# EasyEDA schematic EasyEDA Device Schem.json
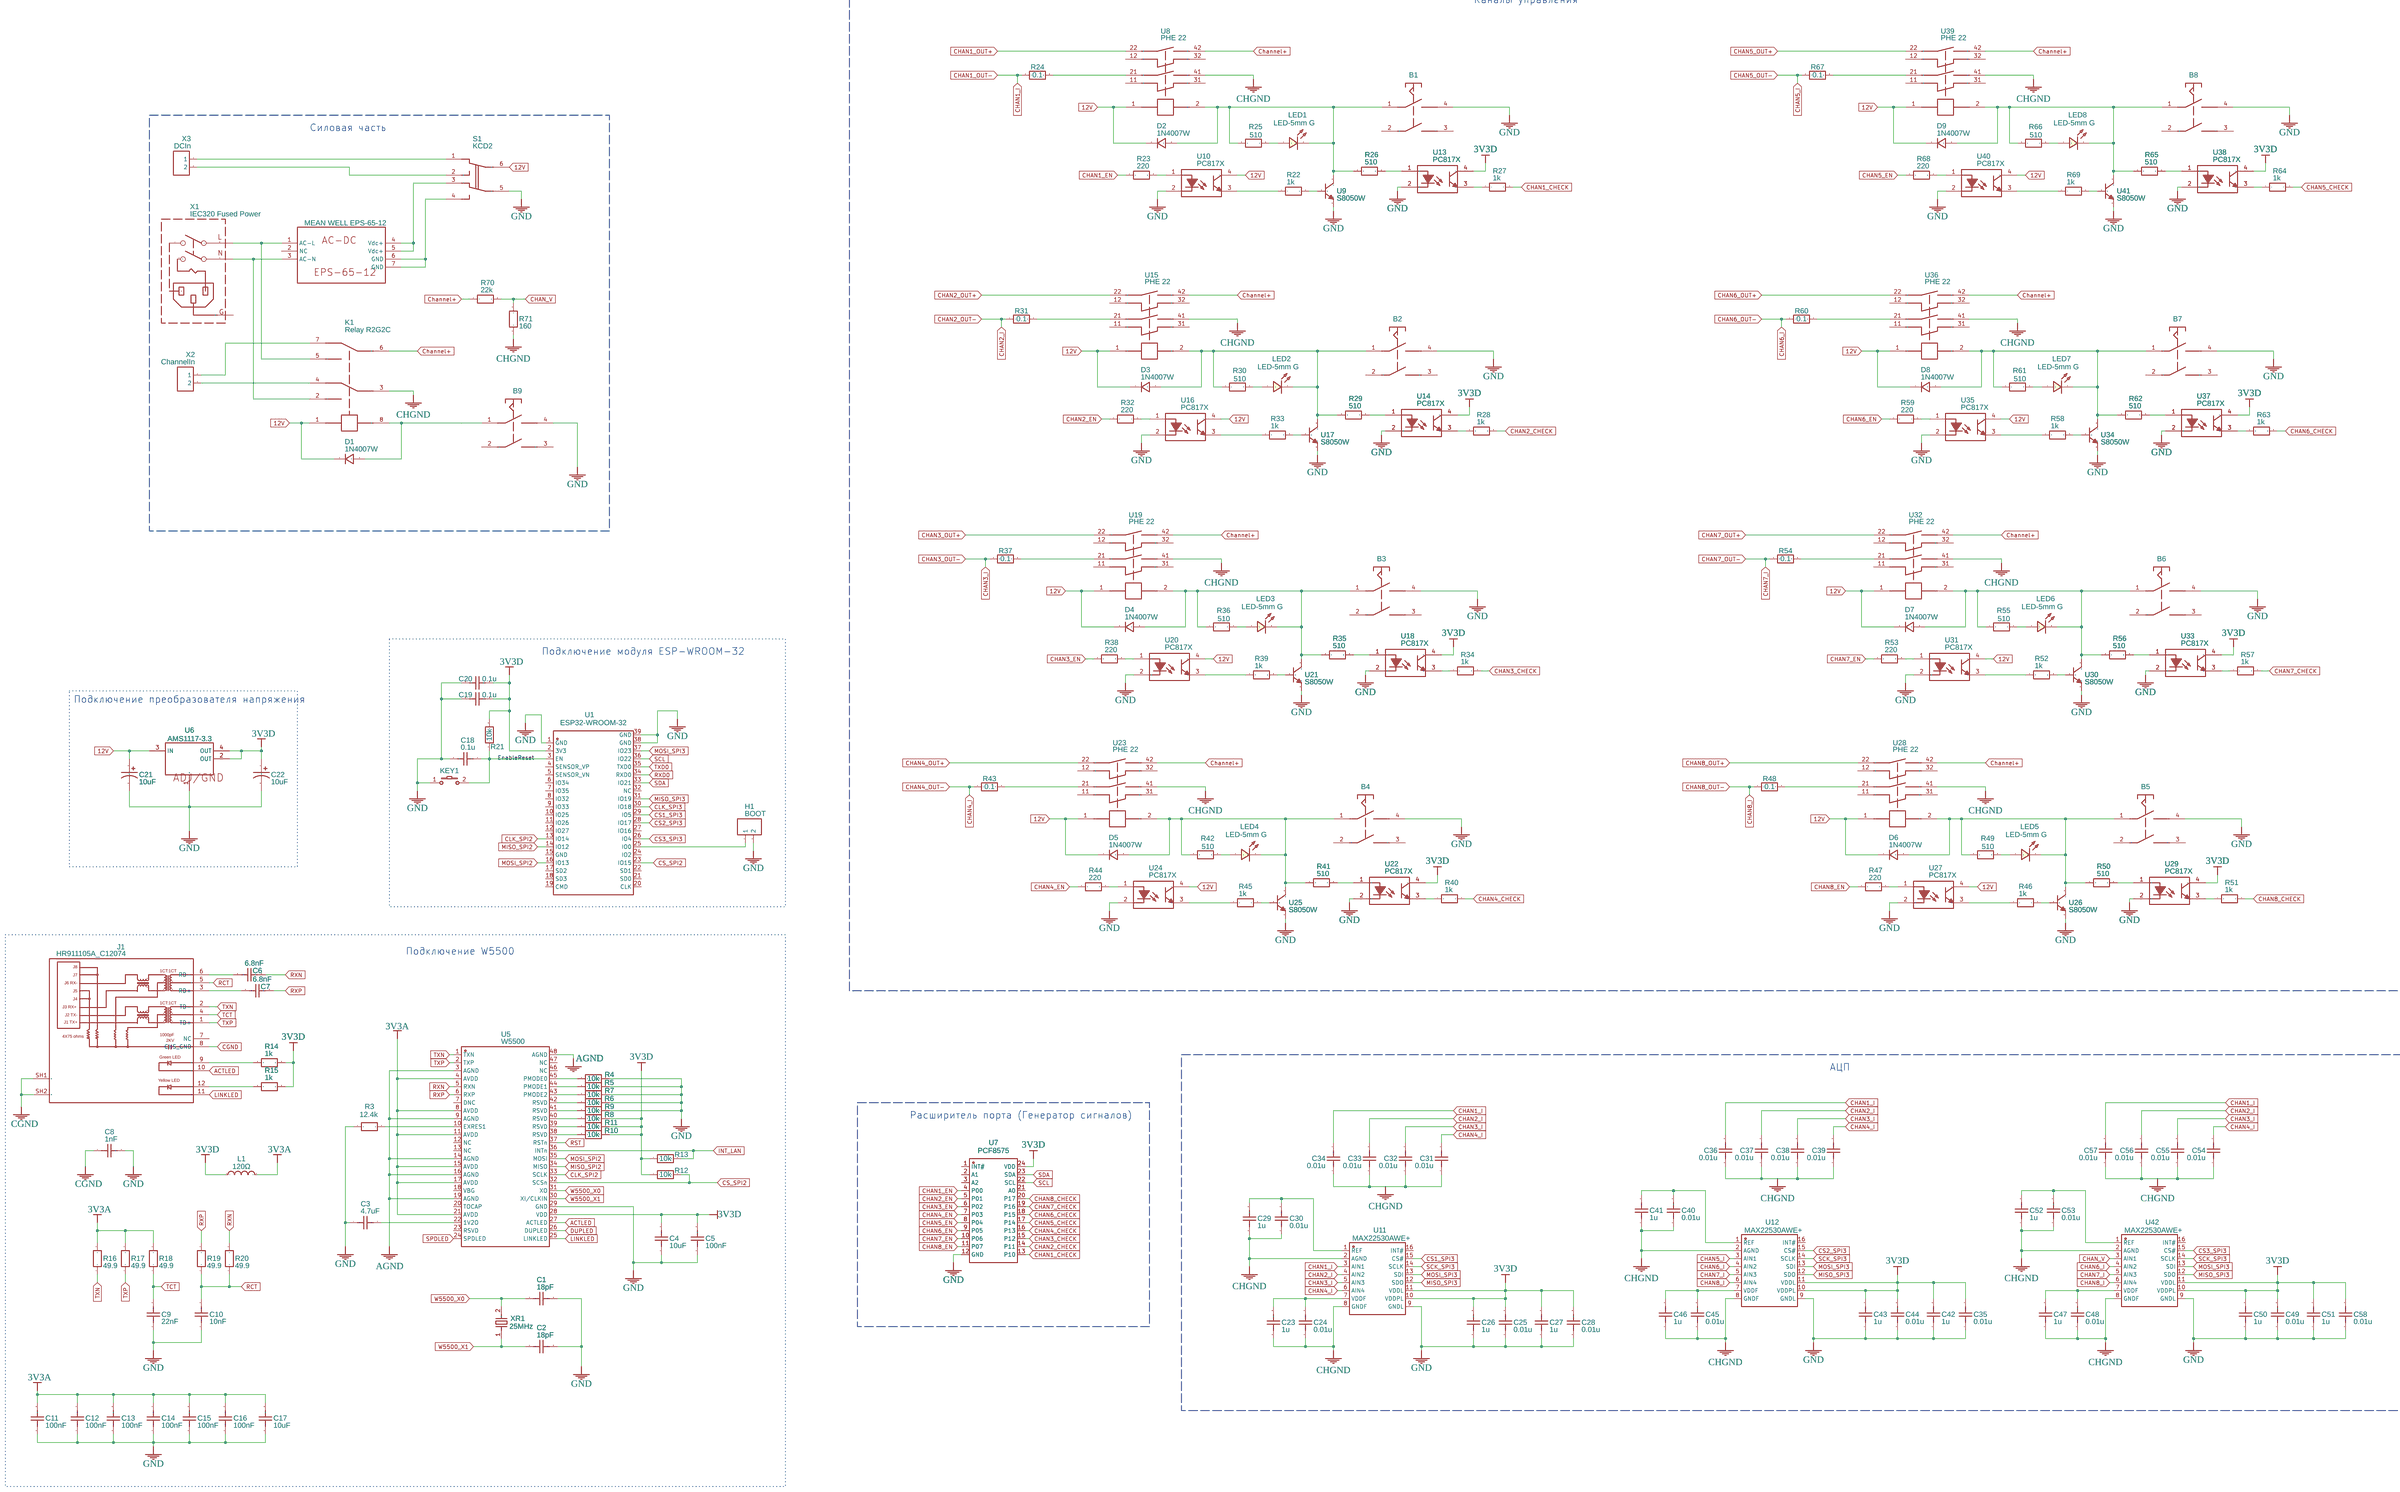
[diagram p0: schematic sheet]

## Parts
B1  Выключатель кнопочный с фиксацией
B2  Выключатель кнопочный с фиксацией
B3  Выключатель кнопочный с фиксацией
B4  Выключатель кнопочный с фиксацией
B5  Выключатель кнопочный с фиксацией
B6  Выключатель кнопочный с фиксацией
B7  Выключатель кнопочный с фиксацией
B8  Выключатель кнопочный с фиксацией
B9  Выключатель кнопочный с фиксацией
C1  18pF  [C0805]
C2  18pF  [C0805]
C3  4.7uF  [C0805]
C4  10uF  [C0805]
C5  100nF  [C0805]
C6  6.8nF  [C0805]
C7  6.8nF  [C0805]
C8  1nF  [C0805]
C9  22nF  [C0805]
C10  10nF  [C0805]
C11  100nF  [C0805]
C12  100nF  [C0805]
C13  100nF  [C0805]
C14  100nF  [C0805]
C15  100nF  [C0805]
C16  100nF  [C0805]
C17  10uF  [C0805]
C18  0.1u  [C0805]
C19  0.1u  [C0805]
C20  0.1u  [C0805]
C21  10uF  [CASE-A_3216]
C22  10uF  [CASE-A_3216]
C23  1u  [C0805]
C24  0.01u  [C0805]
C25  0.01u  [C0805]
C26  1u  [C0805]
C27  1u  [C0805]
C28  0.01u  [C0805]
C29  1u  [C0805]
C30  0.01u  [C0805]
C31  0.01u  [C0805]
C32  0.01u  [C0805]
C33  0.01u  [C0805]
C34  0.01u  [C0805]
C35  0.01u  [C0805]
C36  0.01u  [C0805]
C37  0.01u  [C0805]
C38  0.01u  [C0805]
C39  0.01u  [C0805]
C40  0.01u  [C0805]
C41  1u  [C0805]
C42  1u  [C0805]
C43  1u  [C0805]
C44  0.01u  [C0805]
C45  0.01u  [C0805]
C46  1u  [C0805]
C47  1u  [C0805]
C48  0.01u  [C0805]
C49  0.01u  [C0805]
C50  1u  [C0805]
C51  1u  [C0805]
C52  1u  [C0805]
C53  0.01u  [C0805]
C54  0.01u  [C0805]
C55  0.01u  [C0805]
C56  0.01u  [C0805]
C57  0.01u  [C0805]
C58  0.01u  [C0805]
D1  1N4007W  [SOD-123_L2.8-W1.8-LS3.7-RD]
D2  1N4007W  [SOD-123_L2.8-W1.8-LS3.7-RD]
D3  1N4007W  [SOD-123_L2.8-W1.8-LS3.7-RD]
D4  1N4007W  [SOD-123_L2.8-W1.8-LS3.7-RD]
D5  1N4007W  [SOD-123_L2.8-W1.8-LS3.7-RD]
D6  1N4007W  [SOD-123_L2.8-W1.8-LS3.7-RD]
D7  1N4007W  [SOD-123_L2.8-W1.8-LS3.7-RD]
D8  1N4007W  [SOD-123_L2.8-W1.8-LS3.7-RD]
D9  1N4007W  [SOD-123_L2.8-W1.8-LS3.7-RD]
H1  BOOT  [HDR-F-2.54_1X2]
J1  HR911105A_C12074  [RJ45-TH_HR911105A]
K1  Relay R2G2C
KEY1  K2-3.6×6.1_SMD  [KEY-SMD_2P-L6.2-W3.6-LS8.0]
L1  120Ω  [L0603]
LED1  LED-5mm G  [LED-TH_BD3.0_GREEN]
LED2  LED-5mm G  [LED-TH_BD3.0_GREEN]
LED3  LED-5mm G  [LED-TH_BD3.0_GREEN]
LED4  LED-5mm G  [LED-TH_BD3.0_GREEN]
LED5  LED-5mm G  [LED-TH_BD3.0_GREEN]
LED6  LED-5mm G  [LED-TH_BD3.0_GREEN]
LED7  LED-5mm G  [LED-TH_BD3.0_GREEN]
LED8  LED-5mm G  [LED-TH_BD3.0_GREEN]
R3  12.4k  [R0805]
R4  10k  [R0805]
R5  10k  [R0805]
R6  10k  [R0805]
R7  10k  [R0805]
R8  10k  [R0805]
R9  10k  [R0805]
R10  10k  [R0805]
R11  10k  [R0805]
R12  10k  [R0805]
R13  10k  [R0805]
R14  1k  [R0805]
R15  1k  [R0805]
R16  49.9  [R0805]
R17  49.9  [R0805]
R18  49.9  [R0805]
R19  49.9  [R0805]
R20  49.9  [R0805]
R21  10k  [R0805]
R22  1k  [R0805]
R23  220  [R0805]
R24  0.1  [R0805]
R25  510  [R0805]
R26  510  [R0805]
R27  1k  [R0805]
R28  1k  [R0805]
R29  510  [R0805]
R30  510  [R0805]
R31  0.1  [R0805]
R32  220  [R0805]
R33  1k  [R0805]
R34  1k  [R0805]
R35  510  [R0805]
R36  510  [R0805]
R37  0.1  [R0805]
R38  220  [R0805]
R39  1k  [R0805]
R40  1k  [R0805]
R41  510  [R0805]
R42  510  [R0805]
R43  0.1  [R0805]
R44  220  [R0805]
R45  1k  [R0805]
R46  1k  [R0805]
R47  220  [R0805]
R48  0.1  [R0805]
R49  510  [R0805]
R50  510  [R0805]
R51  1k  [R0805]
R52  1k  [R0805]
R53  220  [R0805]
R54  0.1  [R0805]
R55  510  [R0805]
R56  510  [R0805]
R57  1k  [R0805]
R58  1k  [R0805]
R59  220  [R0805]
R60  0.1  [R0805]
R61  510  [R0805]
R62  510  [R0805]
R63  1k  [R0805]
R64  1k  [R0805]
R65  510  [R0805]
R66  510  [R0805]
R67  0.1  [R0805]
R68  220  [R0805]
R69  1k  [R0805]
R70  22k  [R0805]
R71  160  [R0805]
S1  KCD2
U1  ESP32-WROOM-32  [WIFIM-SMD_39P-L25.5-W18.0-P1.27]
U2  MEAN WELL EPS-65-12
U5  W5500  [LQFP-48_L7.0-W7.0-P0.50-LS9.0-BL]
U6  AMS1117-3.3  [SOT-223-3_L6.4-W3.5-P2.30-LS7.0-BR]
U7  PCF8575  [SSOP-24_L8.2-W5.3-P0.65-LS7.8-BL]
U8  РНЕ 22
U9  S8050W  [SOT-323-3_L2.1-W1.3-P1.30-LS2.3-BR]
U10  PC817X  [DIP-4_L4.6-W6.5-P2.54-LS7.6-BL]
U11  MAX22530AWE+  [SOIC-16_L10.3-W7.5-P1.27-LS10.3-BL]
U12  MAX22530AWE+  [SOIC-16_L10.3-W7.5-P1.27-LS10.3-BL]
U13  PC817X  [DIP-4_L4.6-W6.5-P2.54-LS7.6-BL]
U14  PC817X  [DIP-4_L4.6-W6.5-P2.54-LS7.6-BL]
U15  РНЕ 22
U16  PC817X  [DIP-4_L4.6-W6.5-P2.54-LS7.6-BL]
U17  S8050W  [SOT-323-3_L2.1-W1.3-P1.30-LS2.3-BR]
U18  PC817X  [DIP-4_L4.6-W6.5-P2.54-LS7.6-BL]
U19  РНЕ 22
U20  PC817X  [DIP-4_L4.6-W6.5-P2.54-LS7.6-BL]
U21  S8050W  [SOT-323-3_L2.1-W1.3-P1.30-LS2.3-BR]
U22  PC817X  [DIP-4_L4.6-W6.5-P2.54-LS7.6-BL]
U23  РНЕ 22
U24  PC817X  [DIP-4_L4.6-W6.5-P2.54-LS7.6-BL]
U25  S8050W  [SOT-323-3_L2.1-W1.3-P1.30-LS2.3-BR]
U26  S8050W  [SOT-323-3_L2.1-W1.3-P1.30-LS2.3-BR]
U27  PC817X  [DIP-4_L4.6-W6.5-P2.54-LS7.6-BL]
U28  РНЕ 22
U29  PC817X  [DIP-4_L4.6-W6.5-P2.54-LS7.6-BL]
U30  S8050W  [SOT-323-3_L2.1-W1.3-P1.30-LS2.3-BR]
U31  PC817X  [DIP-4_L4.6-W6.5-P2.54-LS7.6-BL]
U32  РНЕ 22
U33  PC817X  [DIP-4_L4.6-W6.5-P2.54-LS7.6-BL]
U34  S8050W  [SOT-323-3_L2.1-W1.3-P1.30-LS2.3-BR]
U35  PC817X  [DIP-4_L4.6-W6.5-P2.54-LS7.6-BL]
U36  РНЕ 22
U37  PC817X  [DIP-4_L4.6-W6.5-P2.54-LS7.6-BL]
U38  PC817X  [DIP-4_L4.6-W6.5-P2.54-LS7.6-BL]
U39  РНЕ 22
U40  PC817X  [DIP-4_L4.6-W6.5-P2.54-LS7.6-BL]
U41  S8050W  [SOT-323-3_L2.1-W1.3-P1.30-LS2.3-BR]
U42  MAX22530AWE+  [SOIC-16_L10.3-W7.5-P1.27-LS10.3-BL]
X1  IEC320 Fused Power
X2  ChannelIn  [HDR-F-2.54_1X2]
X3  DCIn  [HDR-F-2.54_1X2]
XR1  25MHz  [CRYSTAL-TH_L10.8-W4.5-P4.88]

## Library data of the parts
B1-B9 = Выключатель кнопочный с фиксацией: Manufacturer Part: R13-523BLR; Contributor: maksim.trushkin
C1-C20 C23-C58 = C_0805_US: Contributor: LCEDA_Lib
C21 C22 = C_Tan_SMD_A_US: Contributor: LCEDA_Lib
D1-D9 = 1N4007W: Supplier: LCSC; Supplier Part: C328592; Manufacturer: BLUE ROCKET; Contributor: LCEDA_Lib
H1 X2 X3 = HDR-F-2.54_1x2: Supplier Part: C49661; Supplier: LCSC; Contributor: LCEDA_Lib
J1 = HR911105A_C12074: Supplier: LCSC; Manufacturer: HANRUN(汉仁); Manufacturer Part: HR911105A; Supplier Part: C12074; JLCPCB Part Class: Extended Part
K1 = Relay R2G2C: Manufacturer: Shenle Corporation Ltd.; Manufacturer Part: R2G2C; Contributor: maksim.trushkin
KEY1 = K2-3.6×6.1_SMD: Supplier Part: C118141; Supplier: LCSC; Manufacturer Part: K2-1107ST-A4SW-06; Contributor: LCEDA_Lib; 制造商: 韩国韩荣
L1 = GZ1608D121CTF: Supplier: LCSC; Manufacturer: Sunlord(顺络); Supplier Part: C98270; JLCPCB Part Class: Extended Part
LED1-LED8 = LED-TH-3mm_G: Manufacturer: EVERLIGHT(台湾亿光); Manufacturer Part: 204-10SYGD/S530-E3; Supplier Part: C85161; Contributor: LCEDA_Lib
R3-R71 = R_0805_EU: Contributor: LCEDA_Lib
S1 = Переключатель KCD2: Manufacturer: YUEQING; Contributor: maksim.trushkin
U1 = ESP32-WROOM-32(M103QH6400PH3Q0): Supplier: LCSC; Supplier Part: C6244703; Manufacturer: ESPRESSIF(乐鑫); JLCPCB Part Class: Extended Part; Contributor: lcsc
U2 = MEAN WELL EPS-65-12: Manufacturer: MEAN WELL; Manufacturer Part: EPS-65-12; Contributor: maksim.trushkin
U5 = W5500: Supplier: LCSC; Manufacturer: WIZNET; Supplier Part: C32843; JLCPCB Part Class: Extended Part
U6 = AMS1117-3.3_C2992570: Contributor: lcsc; Supplier: LCSC; Supplier Part: C2992570; Manufacturer: 国芯佳品; JLCPCB Part Class: Extended Part
U7 = PCF8575TS/1,118_C2652296: Contributor: LCSC; Supplier: LCSC; Supplier Part: C2652296; Manufacturer: NXP(恩智浦); Manufacturer Part: PCF8575TS/1,118; JLCPCB Part Class: Extended Part
U8 U15 U19 U23 U28 U32 U36 U39 = РНЕ 22: Contributor: maksim.trushkin
U9 U17 U21 U25 U26 U30 U34 U41 = S8050W: Contributor: lcsc; Supplier: LCSC; Supplier Part: C5186011; Manufacturer: Slkor(萨科微); JLCPCB Part Class: Extended Part
U10 U13 U14 U16 U18 U20 U22 U24 U27 U29 U31 U33 U35 U37 U38 U40 = PC817X1NSZ2B: Contributor: LCSC; Supplier: LCSC; Supplier Part: C410323; Manufacturer: SHARP(夏普); JLCPCB Part Class: Extended Part
U11 U12 U42 = MAX22530AWE+: Supplier: LCSC; Supplier Part: C6419631; Manufacturer: ADI(亚德诺)/MAXIM(美信); JLCPCB Part Class: Extended Part; Contributor: lcsc
X1 = IEC320 Fused Power: Manufacturer Part: BVB01/Z0000/11; Contributor: Chadnaut; Manufacturer: Bulgin; Supplier: RS-Online; Supplier Part: 352-1869
XR1 = SP2004M91520001: Supplier: LCSC; Supplier Part: C7294710; Manufacturer: HUAXIN(华昕); Contributor: lcsc

## Nets
3V3A: C11.2 C12.2 C13.2 C14.2 C15.2 C16.2 C17.2 L1.2 R16.2 R17.2 R18.2 U5.4(AVDD) U5.8(AVDD) U5.11(AVDD) U5.15(AVDD) U5.17(AVDD) U5.21(AVDD)
3V3D: C4.2 C5.2 C19.2 C20.2 C22.1 C25.2 C26.2 C27.2 C28.2 C35.2 C42.2 C43.2 C44.2 C49.2 C50.2 C51.2 C58.2 L1.1 R8.2 R10.2 R11.2 R12.1 R13.1 R14.2 R15.2 R21.2 U1.2(3V3) U5.28(VDD) U6.2(OUT) U6.4(OUT) U7.24(VDD) U11.10(VDDPL) U11.11(VDDL) U12.10(VDDPL) U12.11(VDDL) U13.4 U14.4 U18.4 U22.4 U29.4 U33.4 U37.4 U38.4 U42.10(VDDPL) U42.11(VDDL)
12V: C21.1 D1.1 D2.1 D3.1 D4.1 D5.1 D6.1 D7.1 D8.1 D9.1 K1.1 S1.6 U6.3(IN) U8.1 U10.4 U15.1 U16.4 U19.1 U20.4 U23.1 U24.4 U27.4 U28.1 U31.4 U32.1 U35.4 U36.1 U39.1 U40.4
AGND: U5.3(AGND) U5.9(AGND) U5.14(AGND) U5.16(AGND) U5.19(AGND) U5.48(AGND)
GND: B1.4 B2.4 B3.4 B4.4 B5.4 B6.4 B7.4 B8.4 B9.4 C1.2 C2.2 C3.1 C4.1 C5.1 C8.2 C9.1 C10.1 C11.1 C12.1 C13.1 C14.1 C15.1 C16.1 C17.1 C18.2 C19.1 C20.1 C21.2 C22.2 C25.1 C26.1 C27.1 C28.1 C35.1 C42.1 C43.1 C44.1 C49.1 C50.1 C51.1 C58.1 H1.2 KEY1.1 R3.1 R4.2 R5.2 R6.2 R7.2 R9.2 S1.5 U1.1(GND) U1.38(GND) U1.39(GND) U5.29(GND) U6.1(ADJ/GND) U7.12(GND) U9.2(E) U10.2 U11.9(GNDL) U12.9(GNDL) U13.2 U14.2 U16.2 U17.2(E) U18.2 U20.2 U21.2(E) U22.2 U24.2 U25.2(E) U26.2(E) U27.2 U29.2 U30.2(E) U31.2 U33.2 U34.2(E) U35.2 U37.2 U38.2 U40.2 U41.2(E) U42.9(GNDL)
ACTLED: J1.10 U5.27(ACTLED)
CGND: C8.1 J1.8(CHS GND) J1.SH1 J1.SH2
CHAN1_CHECK: R27.2 U7.13(P10)
CHAN1_EN: R23.1 U7.4(P00)
CHAN1_I: C34.2 C36.2 C57.2 R24.1 U11.3(AIN1)
CHAN1_OUT+: U8.22
CHAN2_CHECK: R28.2 U7.14(P11)
CHAN2_EN: R32.1 U7.5(P01)
CHAN2_I: C33.2 C37.2 C56.2 R31.1 U11.4(AIN2)
CHAN2_OUT+: U15.22
CHAN3_CHECK: R34.2 U7.15(P12)
CHAN3_EN: R38.1 U7.6(P02)
CHAN3_I: C32.2 C38.2 C55.2 R37.1 U11.5(AIN3)
CHAN3_OUT+: U19.22
CHAN4_CHECK: R40.2 U7.16(P13)
CHAN4_EN: R44.1 U7.7(P03)
CHAN4_I: C31.2 C39.2 C54.2 R43.1 U11.6(AIN4)
CHAN4_OUT+: U23.22
CHAN5_CHECK: R64.2 U7.17(P14)
CHAN5_EN: R68.1 U7.8(P04)
CHAN5_I: R67.1 U12.3(AIN1)
CHAN5_OUT+: U39.22
CHAN6_CHECK: R63.2 U7.18(P15)
CHAN6_EN: R59.1 U7.9(P05)
CHAN6_I: R60.1 U12.4(AIN2) U42.4(AIN2)
CHAN6_OUT+: U36.22
CHAN7_CHECK: R57.2 U7.19(P16)
CHAN7_EN: R53.1 U7.10(P06)
CHAN7_I: R54.1 U12.5(AIN3) U42.5(AIN3)
CHAN7_OUT+: U32.22
CHAN8_CHECK: R51.2 U7.20(P17)
CHAN8_EN: R47.1 U7.11(P07)
CHAN8_I: R48.1 U12.6(AIN4) U42.6(AIN4)
CHAN8_OUT+: U28.22
CHAN_V: R70.2 R71.2 U42.3(AIN1)
Channel+: K1.6 R70.1 U8.42 U15.42 U19.42 U23.42 U28.42 U32.42 U36.42 U39.42
CHGND: C23.1 C24.1 C29.1 C30.1 C31.1 C32.1 C33.1 C34.1 C36.1 C37.1 C38.1 C39.1 C40.1 C41.1 C45.1 C46.1 C47.1 C48.1 C52.1 C53.1 C54.1 C55.1 C56.1 C57.1 K1.3 R71.1 U8.41 U11.2(AGND) U11.8(GNDF) U12.2(AGND) U12.8(GNDF) U15.41 U19.41 U23.41 U28.41 U32.41 U36.41 U39.41 U42.2(AGND) U42.8(GNDF)
CLK_SPI2: U1.13(IO14) U5.33(SCLK)
CLK_SPI3: U1.30(IO18)
CS1_SPI3: U1.29(IO5) U11.15(CS#)
CS2_SPI3: U1.28(IO17) U12.15(CS#)
CS3_SPI3: U1.26(IO4) U42.15(CS#)
CS_SPI2: R12.2 U1.23(IO15) U5.32(SCSn)
DUPLED: U5.26(DUPLED)
EnableReset: C18.1 KEY1.2 R21.1 U1.3(EN)
INT_LAN: R13.2 U5.36(INTn)
LINKLED: J1.11 U5.25(LINKLED)
MISO_SPI2: U1.14(IO12) U5.34(MISO)
MISO_SPI3: U1.31(IO19) U11.12(SDO) U12.12(SDO) U42.12(SDO)
MOSI_SPI2: U1.16(IO13) U5.35(MOSI)
MOSI_SPI3: U1.37(IO23) U11.13(SDI) U12.13(SDI) U42.13(SDI)
RCT: C10.2 J1.5 R19.1 R20.1
RST: U5.37(RSTn)
RXD0: U1.34(RXD0)
RXN: C6.2 R20.2 U5.5(RXN)
RXP: C7.2 R19.2 U5.6(RXP)
SCK_SPI3: U11.14(SCLK) U12.14(SCLK) U42.14(SCLK)
SCL: U1.36(IO22) U7.22(SCL)
SDA: U1.33(IO21) U7.23(SDA)
SPDLED: U5.24(SPDLED)
TCT: C9.2 J1.4 R18.1
TXD0: U1.35(TXD0)
TXN: J1.2(TD-) R16.1 U5.1(TXN)
TXP: J1.1(TD+) R17.1 U5.2(TXP)
W5500_X0: C1.1 U5.31(XO) XR1.2
W5500_X1: C2.1 U5.30(XI/CLKIN) XR1.1
Net-(B1-1): B1.1 D2.2 LED1.2 R25.1 R26.1 U8.2 U9.3(C)
Net-(B2-1): B2.1 D3.2 LED2.2 R29.1 R30.1 U15.2 U17.3(C)
Net-(B3-1): B3.1 D4.2 LED3.2 R35.1 R36.1 U19.2 U21.3(C)
Net-(B4-1): B4.1 D5.2 LED4.2 R41.1 R42.1 U23.2 U25.3(C)
Net-(B5-1): B5.1 D6.2 LED5.2 R49.1 R50.1 U26.3(C) U28.2
Net-(B6-1): B6.1 D7.2 LED6.2 R55.1 R56.1 U30.3(C) U32.2
Net-(B7-1): B7.1 D8.2 LED7.2 R61.1 R62.1 U34.3(C) U36.2
Net-(B8-1): B8.1 D9.2 LED8.2 R65.1 R66.1 U39.2 U41.3(C)
Net-(B9-1): B9.1 D1.2 K1.8
Net-(C3-2): C3.2 U5.22(1V2O)
Net-(C6-1): C6.1 J1.6(RD-)
Net-(C7-1): C7.1 J1.3(RD+)
Net-(C23-2): C23.2 C24.2 U11.7(VDDF)
Net-(C29-2): C29.2 C30.2 U11.1(REF)
Net-(C40-2): C40.2 C41.2 U12.1(REF)
Net-(C45-2): C45.2 C46.2 U12.7(VDDF)
Net-(C47-2): C47.2 C48.2 U42.7(VDDF)
Net-(C52-2): C52.2 C53.2 U42.1(REF)
Net-(H1-1): H1.1 U1.25(IO0)
Net-(J1-9): J1.9 R14.1
Net-(J1-12): J1.12 R15.1
Net-(K1-2): K1.2 U2.3(AC-N) X1.1(L)
Net-(K1-4): K1.4 X2.2
Net-(K1-5): K1.5 U2.1(AC-L) X1.3(N)
Net-(K1-7): K1.7 X2.1
Net-(LED1-1): LED1.1 R25.2
Net-(LED2-1): LED2.1 R30.2
Net-(LED3-1): LED3.1 R36.2
Net-(LED4-1): LED4.1 R42.2
Net-(LED5-1): LED5.1 R49.2
Net-(LED6-1): LED6.1 R55.2
Net-(LED7-1): LED7.1 R61.2
Net-(LED8-1): LED8.1 R66.2
Net-(R3-2): R3.2 U5.10(EXRES1)
Net-(R4-1): R4.1 U5.45(PMODE0)
Net-(R5-1): R5.1 U5.44(PMODE1)
Net-(R6-1): R6.1 U5.42(RSVD)
Net-(R7-1): R7.1 U5.43(PMODE2)
Net-(R8-1): R8.1 U5.40(RSVD)
Net-(R9-1): R9.1 U5.41(RSVD)
Net-(R10-1): R10.1 U5.38(RSVD)
Net-(R11-1): R11.1 U5.39(RSVD)
Net-(R22-1): R22.1 U10.3
Net-(R22-2): R22.2 U9.1(B)
Net-(R23-2): R23.2 U10.1
Net-(R24-2): R24.2 U8.21
Net-(R26-2): R26.2 U13.1
Net-(R27-1): R27.1 U13.3
Net-(R28-1): R28.1 U14.3
Net-(R29-2): R29.2 U14.1
Net-(R31-2): R31.2 U15.21
Net-(R32-2): R32.2 U16.1
Net-(R33-1): R33.1 U16.3
Net-(R33-2): R33.2 U17.1(B)
Net-(R34-1): R34.1 U18.3
Net-(R35-2): R35.2 U18.1
Net-(R37-2): R37.2 U19.21
Net-(R38-2): R38.2 U20.1
Net-(R39-1): R39.1 U20.3
Net-(R39-2): R39.2 U21.1(B)
Net-(R40-1): R40.1 U22.3
Net-(R41-2): R41.2 U22.1
Net-(R43-2): R43.2 U23.21
Net-(R44-2): R44.2 U24.1
Net-(R45-1): R45.1 U24.3
Net-(R45-2): R45.2 U25.1(B)
Net-(R46-1): R46.1 U27.3
Net-(R46-2): R46.2 U26.1(B)
Net-(R47-2): R47.2 U27.1
Net-(R48-2): R48.2 U28.21
Net-(R50-2): R50.2 U29.1
Net-(R51-1): R51.1 U29.3
Net-(R52-1): R52.1 U31.3
Net-(R52-2): R52.2 U30.1(B)
Net-(R53-2): R53.2 U31.1
Net-(R54-2): R54.2 U32.21
Net-(R56-2): R56.2 U33.1
Net-(R57-1): R57.1 U33.3
Net-(R58-1): R58.1 U35.3
Net-(R58-2): R58.2 U34.1(B)
Net-(R59-2): R59.2 U35.1
Net-(R60-2): R60.2 U36.21
Net-(R62-2): R62.2 U37.1
Net-(R63-1): R63.1 U37.3
Net-(R64-1): R64.1 U38.3
Net-(R65-2): R65.2 U38.1
Net-(R67-2): R67.2 U39.21
Net-(R68-2): R68.2 U40.1
Net-(R69-1): R69.1 U40.3
Net-(R69-2): R69.2 U41.1(B)
Net-(S1-1): S1.1 X3.1
Net-(S1-2): S1.2 X3.2
Net-(S1-3): S1.3 U2.4(Vdc+) U2.5(Vdc+)
Net-(S1-4): S1.4 U2.6(GND) U2.7(GND)

Not connected (* = marked no-connect by the designer): B1 2 3; B2 2 3; B3 2 3; B4 2 3; B5 2 3; B6 2 3; B7 2 3; B8 2 3; B9 2 3; J1 7(NC); U1 4(SENSOR_VP) 5(SENSOR_VN) 6(IO34) 7(IO35) 8(IO32) 9(IO33) 10(IO25) 11(IO26) 12(IO27) 15(GND) 17(SD2) 18(SD3) 19(CMD) 20(CLK) 21(SD0) 22(SD1) 24(IO2) 27(IO16) 32(NC); U2 2(NC); U5 7(DNC) 12(NC) 13(NC) 18(VBG) 20(TOCAP) 23(RSVD) 46(NC) 47(NC); U7 1(INT#) 2(A1) 3(A2) 21(A0); U8 11 12 31 32; U11 16(INT#); U12 16(INT#); U15 11 12 31 32; U19 11 12 31 32; U23 11 12 31 32; U28 11 12 31 32; U32 11 12 31 32; U36 11 12 31 32; U39 11 12 31 32; U42 16(INT#); X1 2(G) 4 5

## Notes on the sheet
- Каналы управления
- Силовая часть
- Подключение модуля ESP-WROOM-32
- Подключение преобразователя напряжения
- Подключение W5500
- АЦП
- Расширитель порта (Генератор сигналов)
